# EAGLE design CondizionamentoTL081 (EAGLE 7.2.0)
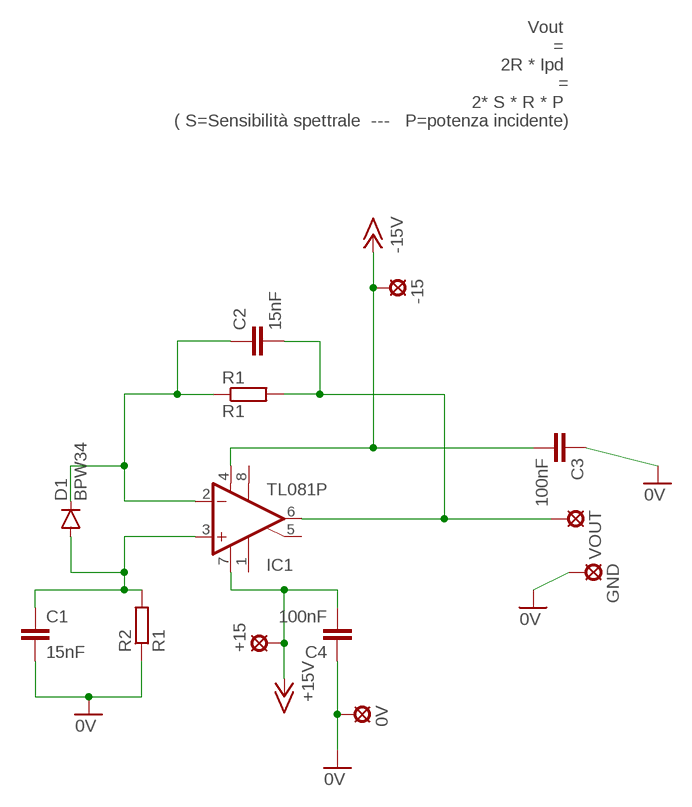
[diagram p0: schematic, sheet 1]

## Parts
0V  0V  LSP10  [LSP10]
+15  +15  LSP10  [LSP10]
-15  -15  LSP10  [LSP10]
C1  15nF  C-EU050-024X044  [C050-024X044]
C2  15nF  C-EU050-024X044  [C050-024X044]
C3  100nF  C-EU050-024X044  [C050-024X044]
C4  100nF  C-EU050-024X044  [C050-024X044]
D1  BPW34  [BPW34]
GND  0V  LSP10  [LSP10]
IC1  TL081P  [DIL08]
R1  R1  R-EU_0207/10  [0207/10]
R2  R1  R-EU_0207/10  [0207/10]
VOUT  Vout  LSP10  [LSP10]

## Nets
0V: 0V.MP C1.2 C3.1 C4.1 GND.MP R2.1
+15V: +15.MP C4.2 IC1.7(V+)
-15V: -15.MP C3.2 IC1.4(V-)
N$1: C2.2 IC1.6(OUT) R1.2 VOUT.MP
N$2: C1.1 D1.P$1(A) IC1.3(+IN) R2.2
N$4: C2.1 D1.P$2(C) IC1.2(-IN) R1.1
Unconnected: IC1.1(ON1) IC1.5(ON2) IC1.8(OPT)

## Notes on the sheet
- Vout 
        = 
  2R * Ipd 
        =
  2* S * R * P 
  ( S=Sensibilità spettrale  ---   P=potenza incidente)

## Library data of the parts
0V +15 -15 GND VOUT = solpad:LSP10: SOLDER PAD drill 1.0 mm, distributor Buerklin, 12H555
C1-C4 = resistor:C-EU: CAPACITOR, European symbol
D1 = SparkFun-Sensors:BPW34: Large-area PIN photodiode ("miniature solar cell") Datasheet: https://www.sparkfun.com/datasheets/Prototyping/Solar/bpw34.pdf; STOREID: 9541
IC1 = linear:TL081: OP AMP
R1 R2 = resistor:R-EU_: RESISTOR, European symbol

## Board
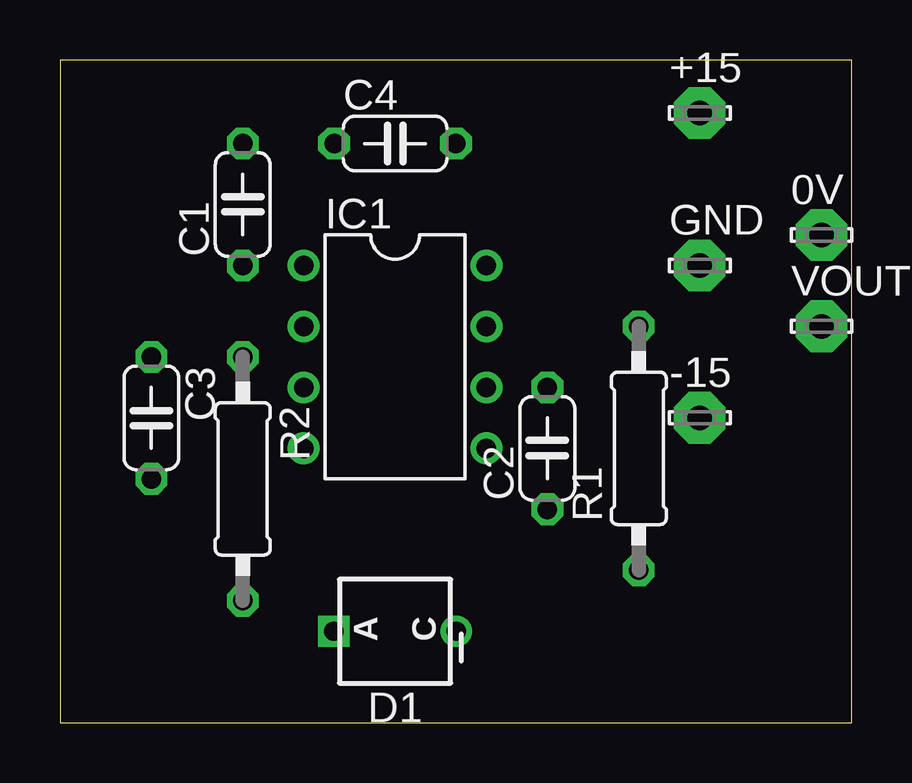
[diagram p1: board, top side]
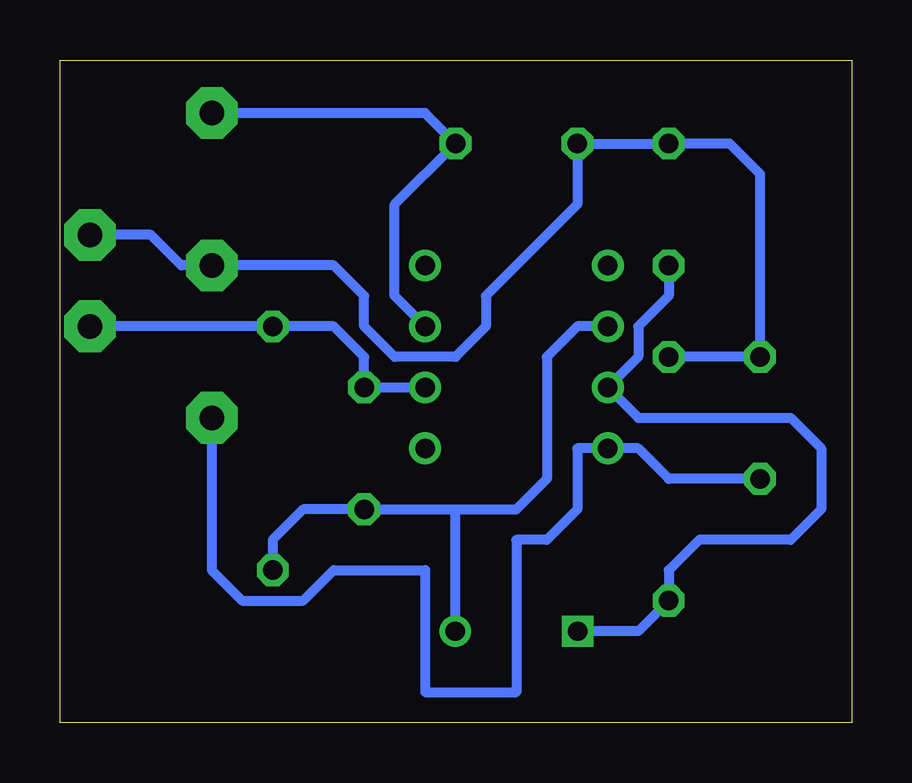
[diagram p2: board, bottom side, seen from below]

Size 33 x 27.61 mm. Coordinates in mm from the lower left corner, seen from the top.
Outline: 0,0 33,0 33,27.61 0,27.61 0,0
Copper layers (1*16): Top 0.035mm / dielectric 1.5mm / Bottom 0.035mm
Design rules "default": minimum track width 10mil, minimum drill 24mil, track to track 8mil, track to pad 8mil, pad to pad 8mil, via to via 8mil, smd to smd 8mil, copper to edge 40mil, drill to drill 8mil, minimum pad ring 10mil, minimum via ring 8mil, stop-mask expansion 4mil, vias tented up to drill 0mil, thermal gap 10mil

### Footprints (pad centres in the part's own frame; a part is rotated, then mirrored left to right if it is on the bottom)
LSP10 = drill 1.016 pad 2.159 octagon: MP 0,0
C050-024X044 = drill 0.813 octagon: 1 -2.54,0; 2 2.54,0
BPW34 = drill 0.8 square: P$1 0,2.55 | drill 0.8: P$2 0,-2.55
DIL08 = drill 0.813 pad 1.27: 1 -3.81,-3.81; 2 -1.27,-3.81; 3 1.27,-3.81; 4 3.81,-3.81; 5 3.81,3.81; 6 1.27,3.81; 7 -1.27,3.81; 8 -3.81,3.81
0207/10 = drill 0.813 octagon: 1 -5.08,0; 2 5.08,0

### Placement (x,y rotation side)
0V  31.75,20.32 0 top
+15  26.67,25.4 0 top
-15  26.67,12.7 0 top
C1  7.62,21.59 90 top
C2  20.32,11.43 90 top
C3  3.81,12.7 270 top
C4  13.97,24.13 0 top
D1  13.97,3.81 90 top
GND  26.67,19.05 0 top
IC1  13.97,15.24 270 top
R1  24.13,11.43 90 top
R2  7.62,10.16 270 top
VOUT  31.75,16.51 0 top

### Tracks (layer width: path | path; a pad name or v marks a point on that pad's centre or on a via)
0V
  Bottom 0.406: R2.1 C3.1 3.81,22.86 5.08,24.13 C1.2 C4.1 11.43,21.59 15.24,17.78 15.24,16.51 16.51,15.24 19.05,15.24 20.32,16.51 20.32,17.78 21.59,19.05 GND.MP 27.94,19.05 29.21,20.32 0V.MP
+15V
  Bottom 0.406: IC1.7 19.05,17.78 19.05,21.59 C4.2 17.78,25.4 +15.MP
-15V
  Bottom 0.406: C3.2 7.62,10.16 8.89,11.43 IC1.4 11.43,11.43 11.43,8.89 12.7,7.62 13.97,7.62 13.97,1.27 17.78,1.27 17.78,6.35 21.59,6.35 22.86,5.08 25.4,5.08 26.67,6.35 -15.MP
N$1
  Bottom 0.406: IC1.6 C2.2 20.32,15.24 21.59,16.51 R1.2 VOUT.MP
N$2
  Bottom 0.406: C1.1 7.62,17.78 8.89,16.51 8.89,15.24 IC1.3 8.89,12.7 2.54,12.7 1.27,11.43 1.27,8.89 2.54,7.62 6.35,7.62 7.62,6.35 R2.2 8.89,3.81 D1.P$1
N$4
  Bottom 0.406: IC1.2 11.43,16.51 12.7,15.24 12.7,10.16 13.97,8.89 16.51,8.89 | 16.51,8.89 C2.1 22.86,8.89 24.13,7.62 R1.1 | D1.P$2 16.51,8.89